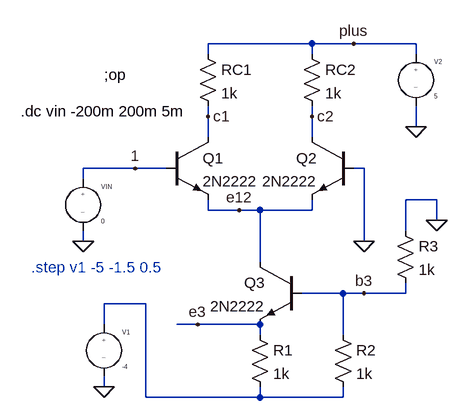
[diagram p0: schematic diff_2.asc]
diff_2.asc, the LTspice schematic file:
Version 4
SHEET 1 880 680
WIRE 352 0 192 0
WIRE 416 0 352 0
WIRE 512 0 416 0
WIRE 192 16 192 0
WIRE 352 16 352 0
WIRE 512 16 512 0
WIRE 192 112 192 96
WIRE 352 112 352 96
WIRE 512 128 512 96
WIRE 192 144 192 112
WIRE 352 144 352 112
WIRE 80 192 0 192
WIRE 128 192 80 192
WIRE 432 192 416 192
WIRE 0 208 0 192
WIRE 544 240 496 240
WIRE 192 256 192 240
WIRE 240 256 192 256
WIRE 272 256 240 256
WIRE 352 256 352 240
WIRE 352 256 272 256
WIRE 544 272 544 240
WIRE 496 288 496 240
WIRE 0 304 0 288
WIRE 432 304 432 192
WIRE 272 336 272 256
WIRE 400 384 336 384
WIRE 432 384 400 384
WIRE 496 384 496 368
WIRE 496 384 432 384
WIRE 96 400 32 400
WIRE 32 432 32 400
WIRE 176 432 144 432
WIRE 272 432 176 432
WIRE 272 448 272 432
WIRE 400 448 400 384
WIRE 32 528 32 512
WIRE 96 544 96 400
WIRE 272 544 272 528
WIRE 272 544 96 544
WIRE 400 544 400 528
WIRE 400 544 272 544
FLAG 512 128 0
FLAG 80 192 1
FLAG 240 256 e12
FLAG 352 112 c2
FLAG 192 112 c1
FLAG 416 0 plus
FLAG 432 384 b3
FLAG 176 432 e3
FLAG 0 304 0
FLAG 432 304 0
FLAG 544 272 0
FLAG 32 528 0
SYMBOL EIT_Semiconductors\\npn 128 144 R0
SYMATTR InstName Q1
SYMATTR Value 2N2222
SYMBOL EIT_Semiconductors\\npn 416 144 M0
SYMATTR InstName Q2
SYMATTR Value 2N2222
SYMBOL res 176 0 R0
SYMATTR InstName RC1
SYMATTR Value 1k
SYMBOL res 336 0 R0
SYMATTR InstName RC2
SYMATTR Value 1k
SYMBOL source-V 0 192 R0
SYMATTR InstName VIN
SYMATTR Value 0
SYMBOL source-V 512 0 R0
SYMATTR InstName V2
SYMATTR Value 5
SYMBOL EIT_Semiconductors\\npn 336 336 M0
SYMATTR InstName Q3
SYMATTR Value 2N2222
SYMBOL res 256 432 R0
SYMATTR InstName R1
SYMATTR Value 1k
SYMBOL res 384 432 R0
SYMATTR InstName R2
SYMATTR Value 1k
SYMBOL res 480 272 R0
SYMATTR InstName R3
SYMATTR Value 1k
SYMBOL source-V 32 416 R0
SYMATTR InstName V1
SYMATTR Value -4
TEXT 32 48 Left 2 !;op
TEXT -96 104 Left 2 !.dc vin -200m 200m 5m
TEXT -80 344 Left 2 ;.step v1 -5 -1.5 0.5

The netlist it stands for:
* diff_2.asc
Q1 c1 1 e12 0 2N2222
Q2 c2 0 e12 0 2N2222
RC1 plus c1 1k
RC2 plus c2 1k
VIN 1 0 0
V2 plus 0 5
Q3 e12 b3 e3 0 2N2222
R1 e3 N001 1k
R2 b3 N001 1k
R3 0 b3 1k
V1 N001 0 -4
.model NPN NPN
.model PNP PNP
.lib standard.bjt
;op
.dc vin -200m 200m 5m
* .step v1 -5 -1.5 0.5
.backanno
.end